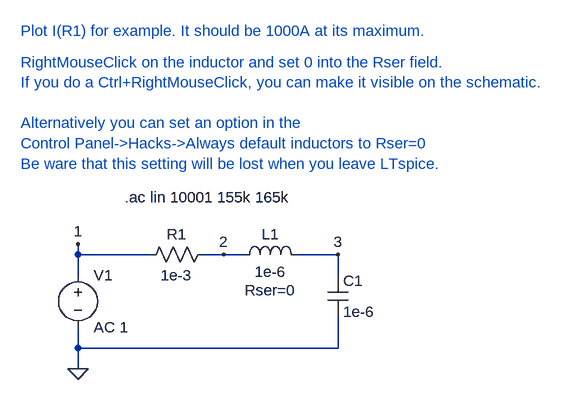
[diagram p0: schematic Lser_0ohm.asc]
Lser_0ohm.asc, the LTspice schematic file:
Version 4
SHEET 1 880 680
WIRE 0 112 0 96
WIRE 112 112 0 112
WIRE 224 112 192 112
WIRE 256 112 224 112
WIRE 400 112 336 112
WIRE 0 144 0 112
WIRE 400 144 400 112
WIRE 0 256 0 224
WIRE 400 256 400 208
WIRE 400 256 0 256
WIRE 0 288 0 256
FLAG 0 288 0
FLAG 0 96 1
FLAG 224 112 2
FLAG 400 112 3
SYMBOL res 96 128 R270
WINDOW 0 32 56 VTop 0
WINDOW 3 0 56 VBottom 0
SYMATTR InstName R1
SYMATTR Value 1e-3
SYMBOL ind 240 128 R270
WINDOW 0 32 56 VTop 0
WINDOW 3 5 56 VBottom 0
WINDOW 39 -23 56 VBottom 0
SYMATTR InstName L1
SYMATTR Value 1e-6
SYMATTR SpiceLine Rser=0
SYMBOL voltage 0 128 R0
SYMATTR InstName V1
SYMATTR Value AC 1
SYMBOL cap 384 144 R0
SYMATTR InstName C1
SYMATTR Value 1e-6
TEXT 72 24 Left 0 !.ac lin 10001 155k 165k
TEXT -88 -184 Left 0 ;RightMouseClick on the inductor and set 0 into the Rser field.\nIf you do a Ctrl+RightMouseClick, you can make it visible on the schematic.\n \nAlternatively you can set an option in the \nControl Panel->Hacks->Always default inductors to Rser=0\nBe ware that this setting will be lost when you leave LTspice.
TEXT -88 -232 Left 0 ;Plot I(R1) for example. It should be 1000A at its maximum.

The netlist it stands for:
* Lser_0ohm.asc
R1 1 2 1e-3
L1 2 3 1e-6 Rser=0
V1 1 0 AC 1
C1 3 0 1e-6
.ac lin 10001 155k 165k
* RightMouseClick on the inductor and set 0 into the Rser field.
* If you do a Ctrl+RightMouseClick, you can make it visible on the schematic.
* Alternatively you can set an option in the
* Control Panel->Hacks->Always default inductors to Rser=0
* Be ware that this setting will be lost when you leave LTspice.
* Plot I(R1) for example. It should be 1000A at its maximum.
.backanno
.end